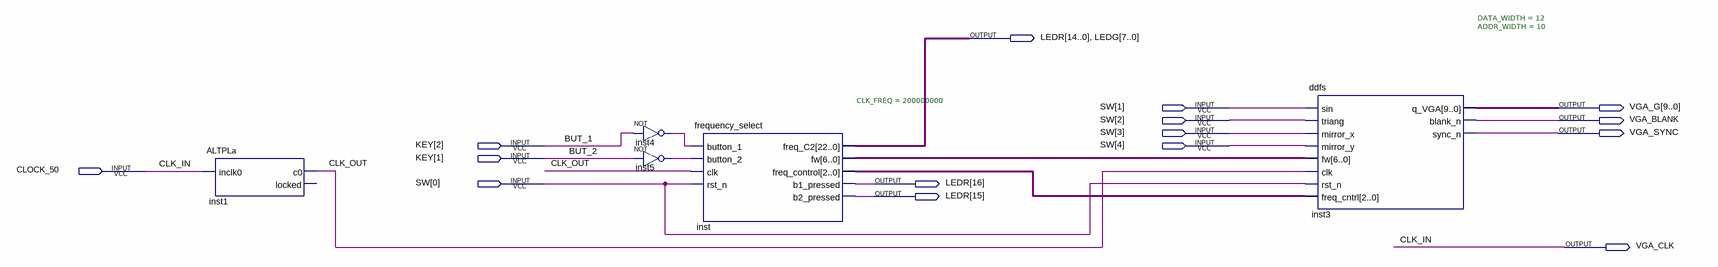
[diagram p0: schematic sheet]
// Quartus schematic funct_gen.bdf as structural Verilog: 5 symbols, 15 pins
module funct_gen (
  input  [4:0] SW,
  input  [2:1] KEY,
  input  CLOCK_50,
  output [16:0] LEDR,
  output [7:0] LEDG,
  output [9:0] VGA_G,
  output VGA_BLANK,
  output VGA_SYNC,
  output VGA_CLK
);

  wire CLK_OUT, inst4_out, inst5_out;
  wire [2:0] inst_freq_control;
  wire [6:0] inst_fw;

  ALTPLa inst1 (.inclk0(CLOCK_50), .c0(CLK_OUT));  // open: locked
  not inst4 (inst4_out, KEY[2]);
  not inst5 (inst5_out, KEY[1]);
  frequency_select #(.CLK_FREQ(200000000)) inst (
    .button_1(inst4_out), .button_2(inst5_out), .clk(CLK_OUT), .rst_n(SW[0]), .freq_C2({LEDR[14:0], LEDG}),
    .fw(inst_fw), .freq_control(inst_freq_control), .b1_pressed(LEDR[16]), .b2_pressed(LEDR[15]));
  ddfs #(.DATA_WIDTH(12), .ADDR_WIDTH(10)) inst3 (
    .sin(SW[1]), .triang(SW[2]), .mirror_x(SW[3]), .mirror_y(SW[4]), .fw(inst_fw), .clk(CLK_OUT),
    .rst_n(SW[0]), .freq_cntrl(inst_freq_control), .q_VGA(VGA_G), .blank_n(VGA_BLANK), .sync_n(VGA_SYNC));

  assign VGA_CLK = CLOCK_50;

  // Other names for the same wires on the sheet: BUT_1 = KEY[2]; BUT_2 = KEY[1]; CLK_IN = CLOCK_50
endmodule
